# EAGLE schematic 436-300-001 Main Power Enclosure (EAGLE 6.5.0)

## Sheet 1 of 2
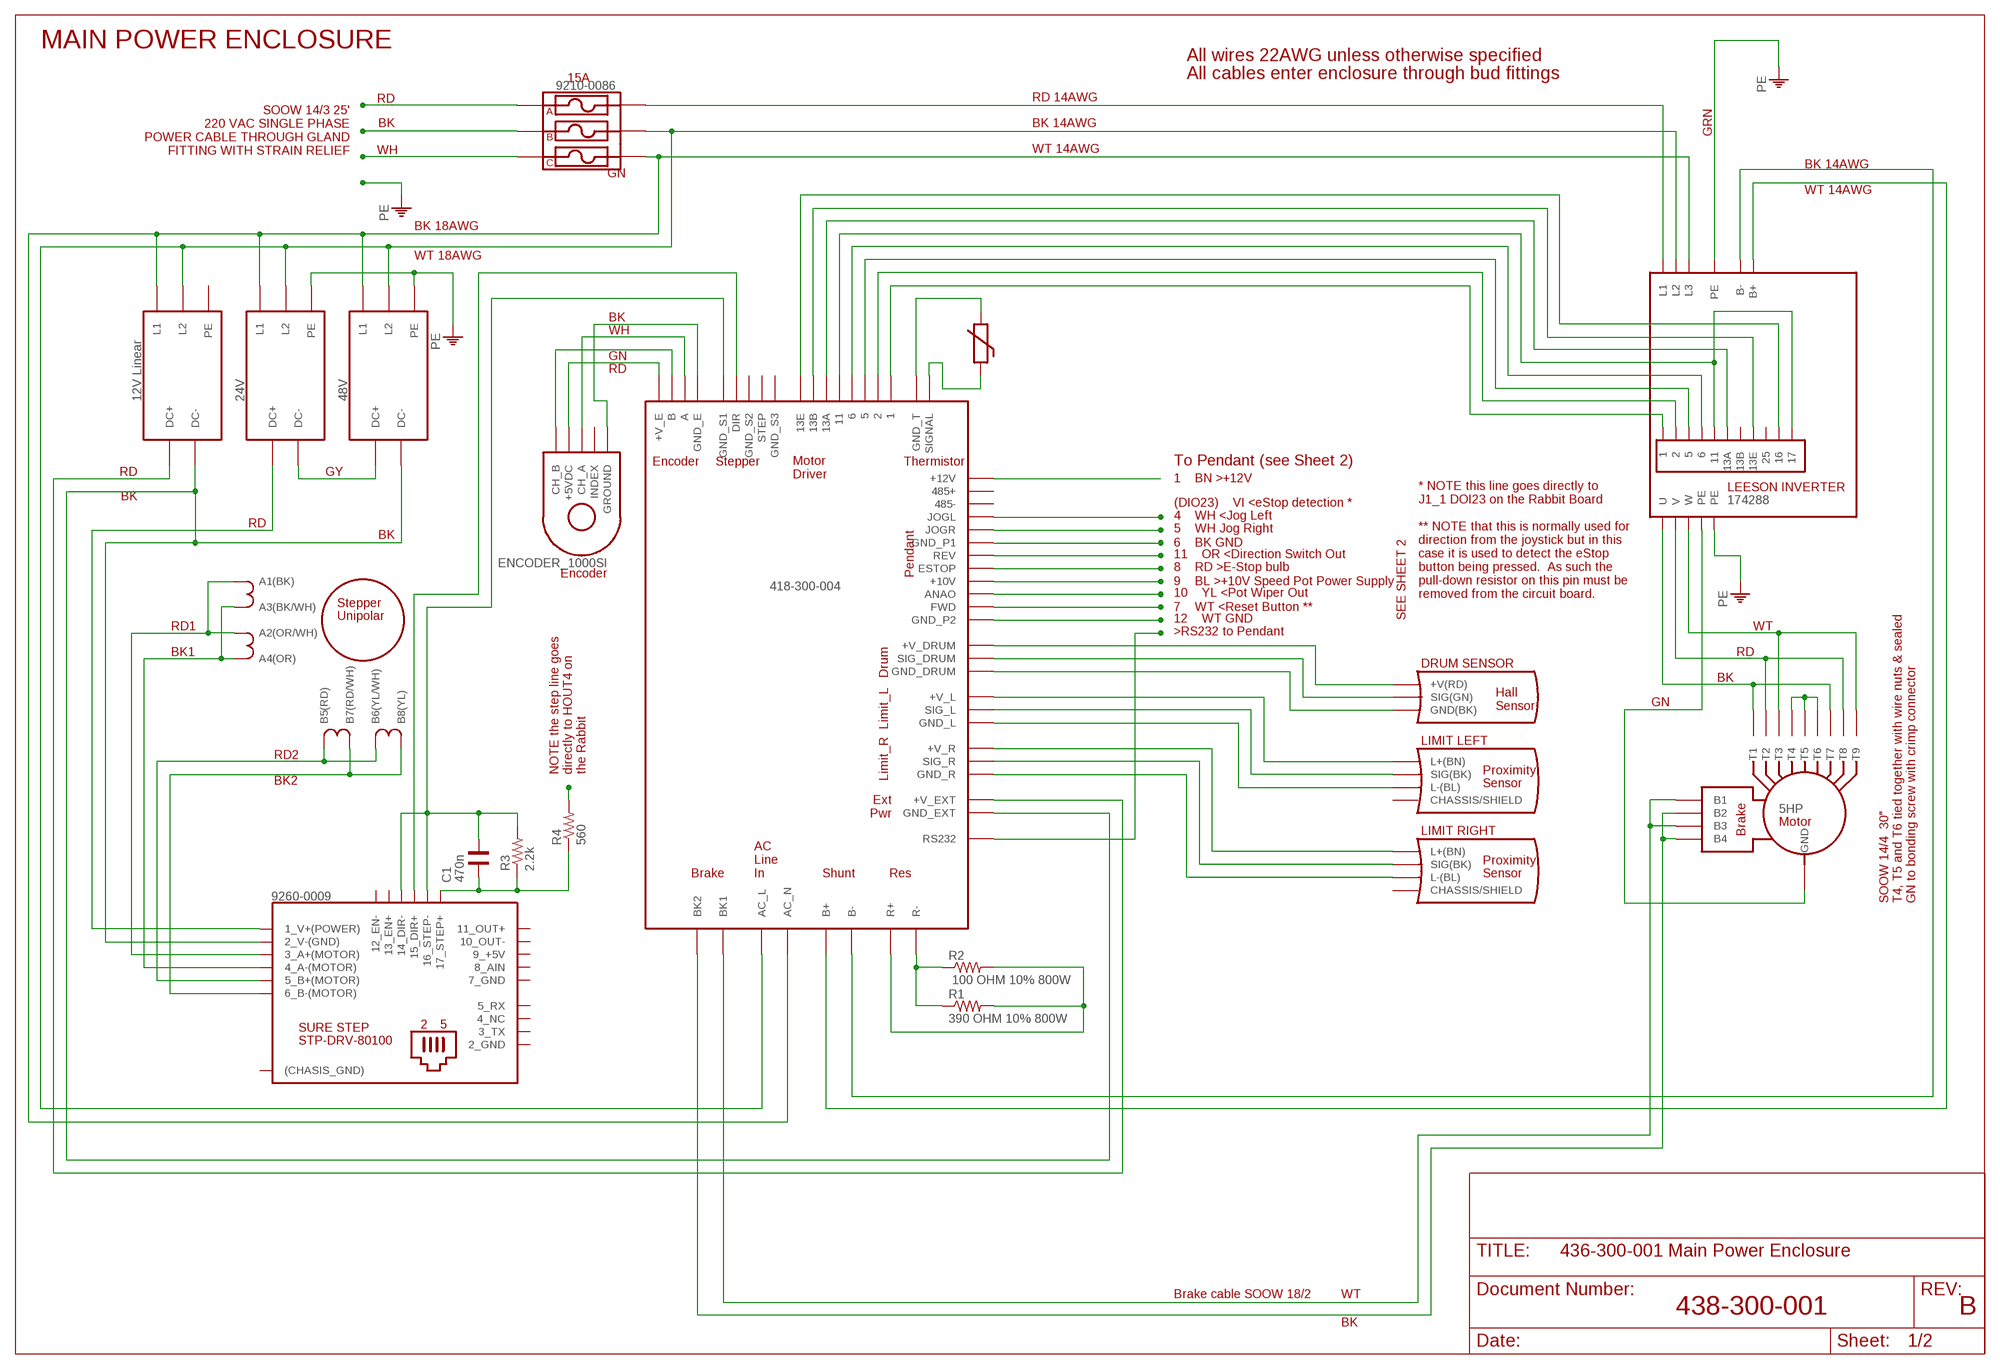
[diagram p0: schematic, sheet 1]

### Parts
C1  470n  C0805  [C0805]
R1  390 OHM 10% 800W  RESISTORKIT  [AXIAL-0.3-KIT]
R2  100 OHM 10% 800W  RESISTORKIT  [AXIAL-0.3-KIT]
R3  2.2k  RESISTOR0805-RES  [0805]
R4  560  RESISTOR0805-RES  [0805]
U$1  CONTROLLER_ECO_0.2  [BOGUS@2]
U$2  THERMISTOR  [BOGUS]
U$3  SENSOR_HALL  [BOGUS@1]
U$4  ENCODER_1000SI  [BOGUS]
U$6  SENSOR_PROXIMITY  [BOGUS]
U$7  5HP  MOTOR_3PH  [BOGUS]
U$8  174288  INVERTER_LEESON_3-PHASE  [BOGUS@2]
U$9  SENSOR_PROXIMITY  [BOGUS]
U$10  24V  POWER_SUPPLY  [BOGUS]
U$11  FUSE_HOLDER_3-POLE  [BOGUS]
U$12  48V  POWER_SUPPLY  [BOGUS]
U$13  MOTOR_STEPPER_UNIPOLAR  [BOGUS]
U$14  SURE_STEP_STP-DRV-80100  [BOGUS]
U$18  12V Linear  POWER_SUPPLY  [BOGUS]

### Nets
N$1: U$8.P$14(L1) U$11.P$3
N$2: U$1.P$36(GND_R) U$9.P$3(L-(BL))
N$3: U$11.P$2
N$4: U$11.P$1
N$5: U$7.P$8(T4) U$7.P$9(T5) U$7.P$10(T6)
N$6: U$1.P$50(SIG_R) U$9.P$4(SIG(BK))
N$7: U$1.P$7(+V_R) U$9.P$2(L+(BN))
N$8: U$7.P$6(T2) U$7.P$12(T8) U$8.P$21(V)
N$9: U$7.P$5(T1) U$7.P$11(T7) U$8.P$20(U)
N$10: U$7.P$14(GND) U$8.P$18(PE)
N$11: U$7.P$7(T3) U$7.P$13(T9) U$8.P$22(W)
N$12: U$1.P$6(+V_L) U$6.P$2(L+(BN))
N$13: U$1.P$49(SIG_L) U$6.P$4(SIG(BK))
N$14: U$1.P$33(GND_L) U$6.P$3(L-(BL))
N$15: U$1.P$26(BK2) U$7.P$2(B2) U$7.P$4(B4)
N$16: U$1.P$19(AC_L) U$8.P$15(L2) U$10.P$4(L2) U$11.P$4 U$12.P$4(L2) U$18.P$4(L2)
N$17: U$1.P$40(GND_T) U$2.P$1
N$18: U$1.P$47(SIGNAL) U$2.P$2
N$19: U$1.P$8 U$8.P$1
N$20: U$1.P$46(RS232)
N$21: U$1.P$9 U$8.P$2
N$22: U$1.P$25(BK1) U$7.P$1(B1) U$7.P$3(B3)
N$23: U$1.P$15(13E) U$8.P$9
N$24: U$1.P$20(AC_N) U$8.P$16(L3) U$10.P$3(L1) U$11.P$6 U$12.P$3(L1) U$18.P$3(L1)
N$25: U$1.P$10 U$8.P$3
N$26: U$1.P$11 U$8.P$4
N$27: U$1.P$12 U$8.P$5 U$8.P$10
N$32: U$1.P$13(13A) U$8.P$6(13A)
N$34: U$1.P$3(+V_DRUM) U$3.P$1(+V(RD))
N$35: U$1.P$48(SIG_DRUM) U$3.P$3(SIG(GN))
N$36: R1.P$1 R2.P$1 U$1.P$44(R-)
N$37: U$1.P$30(GND_DRUM) U$3.P$2(GND(BK))
N$38: U$1.P$14(13B) U$8.P$8(13E)
N$40: U$1.P$4(+V_E) U$4.P$1(+5VDC)
N$41: U$1.P$22(B) U$4.P$3(CH_B)
N$42: U$1.P$18(A) U$4.P$2(CH_A)
N$43: U$1.P$31(GND_E) U$4.P$4(GROUND)
N$44: U$1.P$2(+12V)
N$45: U$1.P$41(JOGL)
N$46: U$1.P$34(GND_P1)
N$47: U$1.P$42(JOGR)
N$48: U$1.P$45(REV)
N$49: U$1.P$28(ESTOP)
N$50: U$1.P$1(+10V)
N$51: U$1.P$21(ANAO)
N$52: U$1.P$29(FWD)
N$53: U$11.P$5
N$54: U$1.P$5(+V_EXT) U$18.P$1(DC+)
N$55: U$1.P$32(GND_EXT) U$12.P$2(DC-) U$14.P$3(2_V-(GND)) U$18.P$2(DC-)
N$56: U$1.P$24(B-) U$8.P$13(B-)
N$57: U$1.P$23(B+) U$8.P$12(B+)
N$59: C1.2 R3.2 U$1.P$37(GND_S1) U$14.P$15(14_DIR-) U$14.P$17(16_STEP-)
N$60: C1.1 R3.1 R4.1 U$14.P$18(17_STEP+)
N$61: U$1.P$27(DIR) U$14.P$16(15_DIR+)
N$62: U$1.P$35(GND_P2)
N$64: U$13.P$3(A3(BK/WH)) U$13.P$4(A4(OR)) U$14.P$5(4_A-(MOTOR))
N$65: U$13.P$1(A1(BK)) U$13.P$2(A2(OR/WH)) U$14.P$4(3_A+(MOTOR))
N$66: U$10.P$1(DC+) U$14.P$2(1_V+(POWER))
N$67: R1.P$2 R2.P$2 U$1.P$43(R+)
N$68: U$10.P$2(DC-) U$12.P$1(DC+)
N$69: U$13.P$5(B5(RD)) U$13.P$6(B6(YL/WH)) U$14.P$6(5_B+(MOTOR))
N$70: U$13.P$7(B7(RD/WH)) U$13.P$8(B8(YL)) U$14.P$7(6_B-(MOTOR))
N$76: R4.2
PE: U$8.P$17(PE) U$8.P$19(PE) U$10.P$5(PE) U$12.P$5(PE)
Unconnected: U$1.P$16(485+) U$1.P$17(485-) U$1.P$38(GND_S2) U$1.P$39(GND_S3) U$1.P$51(STEP) U$4.P$5(INDEX) U$6.P$1(CHASSIS/SHIELD) U$8.P$7(13B) U$8.P$11 U$9.P$1(CHASSIS/SHIELD) U$18.P$5(PE)

### Notes on the sheet
- MAIN POWER ENCLOSURE
- All wires 22AWG unless otherwise specified
- 15A | All cables enter enclosure through bud fittings
- RD | RD 14AWG
- SOOW 14/3 25'
  220 VAC SINGLE PHASE
  POWER CABLE THROUGH GLAND
  FITTING WITH STRAIN RELIEF
- BK | BK 14AWG
- GRN
- WH | WT 14AWG
- BK 14AWG
- GN
- WT 14AWG
- BK 18AWG
- WT 18AWG
- BK
- WH
- GN
- RD
- To Pendant (see Sheet 2)
- RD | GY
- 1    BN >+12V
- BK
- (DIO23)    VI <eStop detection *
- 4    WH <Jog Left
- RD
- 5    WH Jog Right
- BK
- 6    BK GND
- 11    OR <Direction Switch Out
- 8    RD >E-Stop bulb
- 9    BL >+10V Speed Pot Power Supply
- 10    YL <Pot Wiper Out
- * NOTE this line goes directly to
  J1_1 DOI23 on the Rabbit Board
  
  ** NOTE that this is normally used for
  direction from the joystick but in this 
  case it is used to detect the eStop 
  button being pressed.  As such the 
  pull-down resistor on this pin must be 
  removed from the circuit board.
- 7    WT <Reset Button **
- 12    WT GND | SEE SHEET 2
- RD1 | WT
- >RS232 to Pendant
- BK1 | RD
- DRUM SENSOR
- BK
- GN
- LIMIT LEFT
- RD2
- NOTE the step line goes 
  directly to HOUT4 on
  the Rabbit
- BK2
- LIMIT RIGHT
- SOOW 14/4  30"
  T4, T5 and T6 tied together with wire nuts & sealed
  GN to bonding screw with crimp connector
- Brake cable SOOW 18/2 | WT
- 438-300-001 | B
- BK

## Sheet 2 of 2
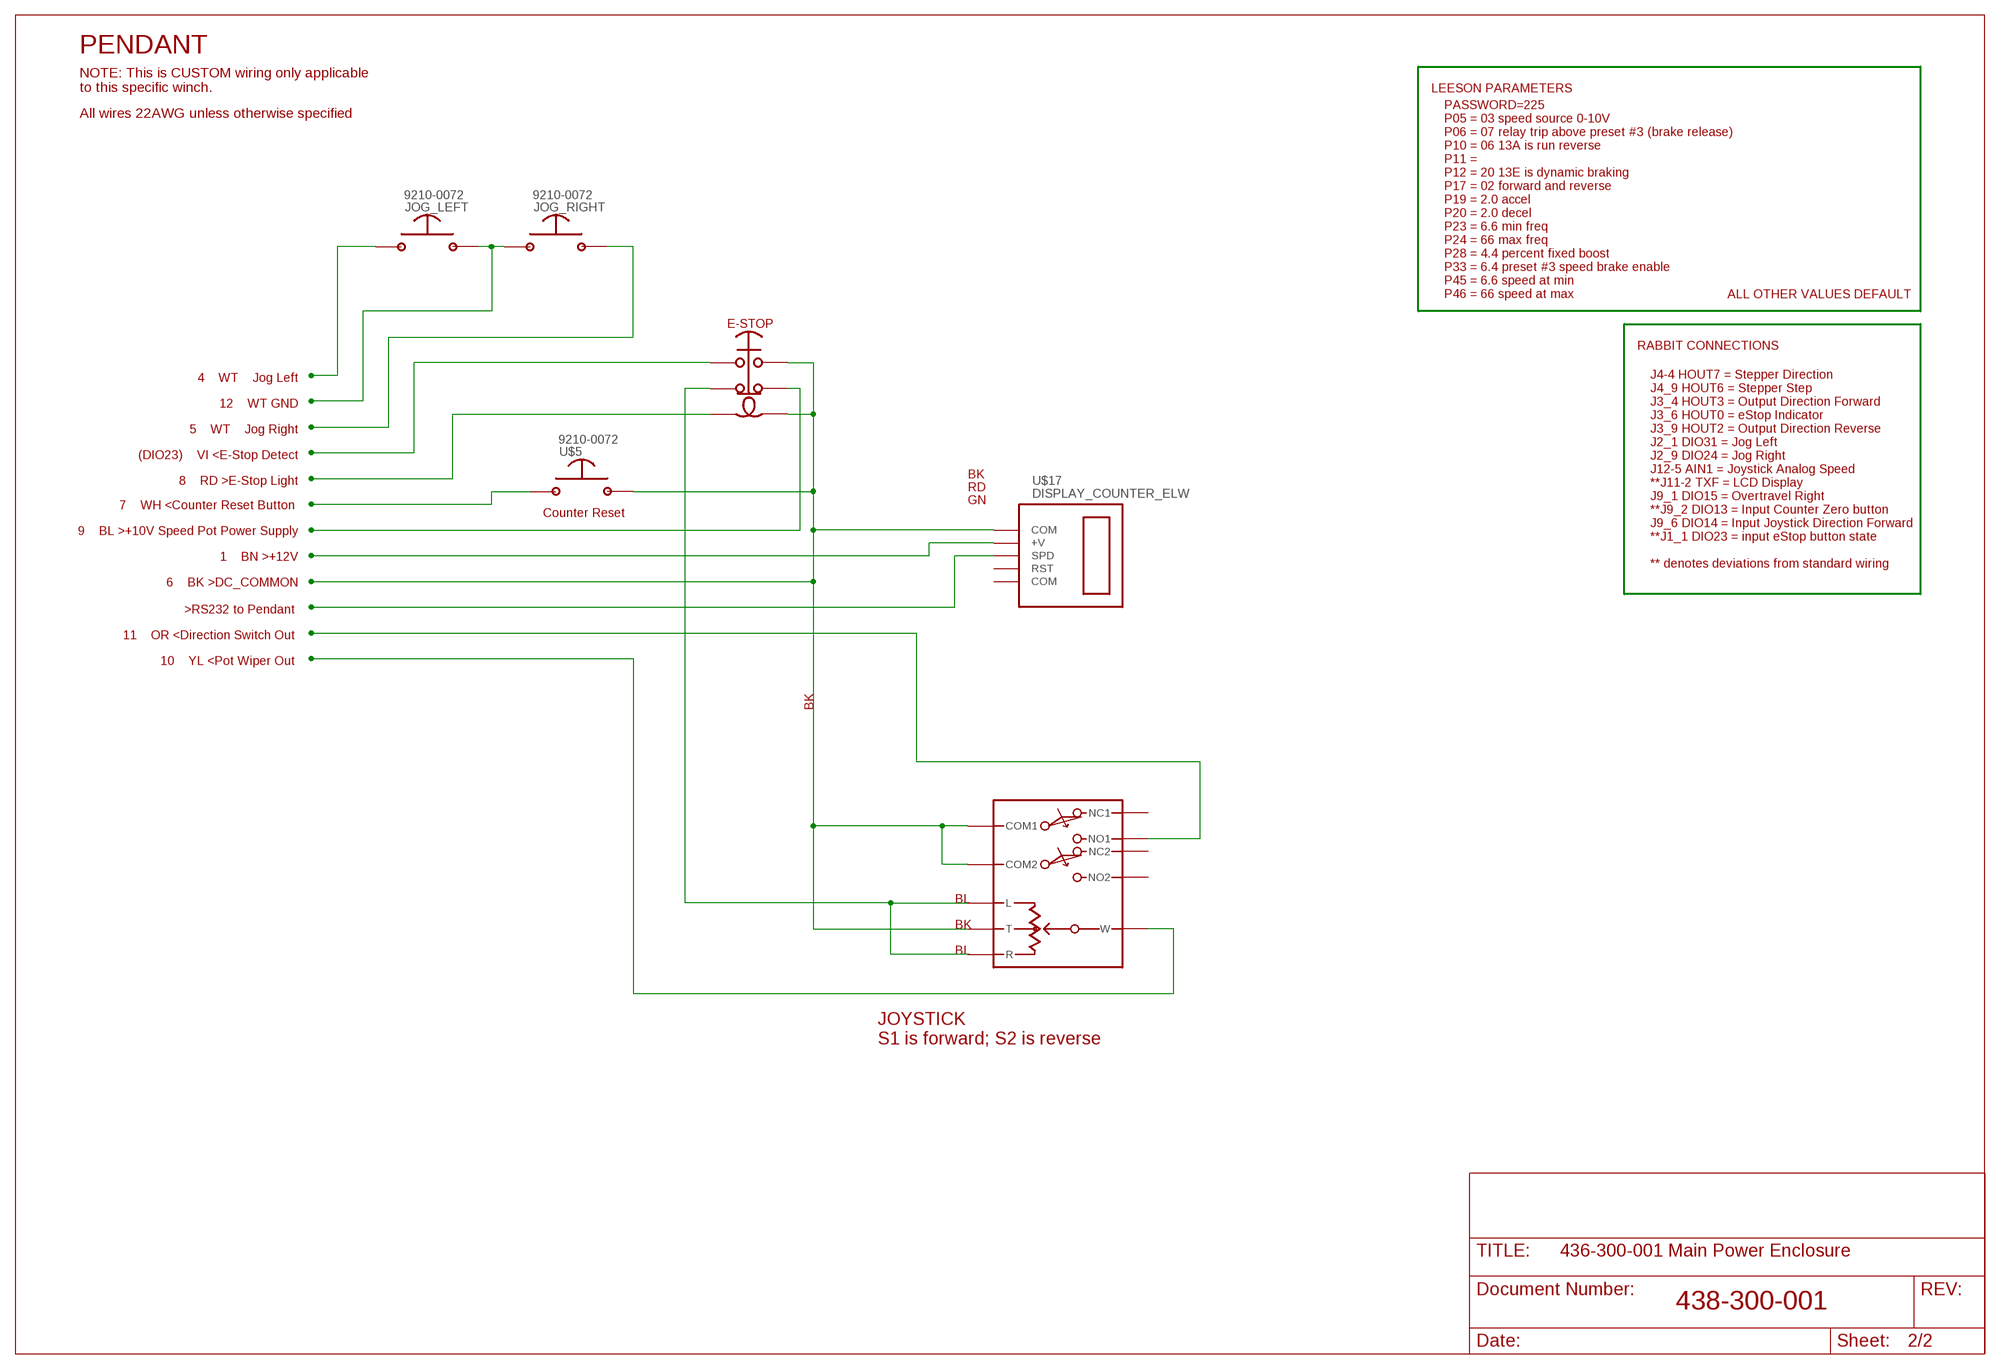
[diagram p1: schematic, sheet 2]

### Parts
JOG_LEFT  Counter Reset  SWITCH_MOM_NO  [BOGUS]
JOG_RIGHT  Counter Reset  SWITCH_MOM_NO  [BOGUS]
U$5  Counter Reset  SWITCH_MOM_NO  [BOGUS]
U$15  SWITCH_ESTOP_LIGHTED  [BOGUS]
U$16  JOYSTICK_PRO-5  [BOGUS]
U$17  DISPLAY_COUNTER_ELW  [BOGUS]

### Nets
N$28: U$17.P$5(SPD)
N$29: U$5.P$1
N$30: U$15.P$1
N$31: U$15.P$2 U$16.P$3(L) U$16.P$8(R)
N$33: U$5.P$2 U$15.P$3 U$15.P$6 U$16.P$1(COM1) U$16.P$2(COM2) U$16.P$9(T) U$17.P$2(COM)
N$58: JOG_RIGHT.P$2
N$63: U$15.P$5
N$71: JOG_LEFT.P$2 JOG_RIGHT.P$1
N$72: U$16.P$6(NO1)
N$73: U$16.P$10(W)
N$74: U$15.P$4
N$75: U$17.P$1(+V)
N$77: JOG_LEFT.P$1
Unconnected: U$16.P$4(NC1) U$16.P$5(NC2) U$16.P$7(NO2) U$17.P$3(COM) U$17.P$4(RST)

### Notes on the sheet
- PENDANT
- NOTE: This is CUSTOM wiring only applicable 
  to this specific winch.
- LEESON PARAMETERS
- All wires 22AWG unless otherwise specified
- PASSWORD=225
  P05 = 03 speed source 0-10V
  P06 = 07 relay trip above preset #3 (brake release)
  P10 = 06 13A is run reverse
  P11 =
  P12 = 20 13E is dynamic braking
  P17 = 02 forward and reverse
  P19 = 2.0 accel
  P20 = 2.0 decel
  P23 = 6.6 min freq
  P24 = 66 max freq
  P28 = 4.4 percent fixed boost
  P33 = 6.4 preset #3 speed brake enable
  P45 = 6.6 speed at min
  P46 = 66 speed at max
- ALL OTHER VALUES DEFAULT
- RABBIT CONNECTIONS
- 4    WT    Jog Left
- 12    WT GND
- 5    WT    Jog Right
- (DIO23)    VI <E-Stop Detect
- 8    RD >E-Stop Light | BK
- RD
- 7    WH <Counter Reset Button
- GN
- Counter Reset
- 9    BL >+10V Speed Pot Power Supply
- 1    BN >+12V
- 6    BK >DC_COMMON
- J4-4 HOUT7 = Stepper Direction
  J4_9 HOUT6 = Stepper Step
  J3_4 HOUT3 = Output Direction Forward
  J3_6 HOUT0 = eStop Indicator
  J3_9 HOUT2 = Output Direction Reverse
  J2_1 DIO31 = Jog Left
  J2_9 DIO24 = Jog Right
  J12-5 AIN1 = Joystick Analog Speed
  **J11-2 TXF = LCD Display
  J9_1 DIO15 = Overtravel Right
  **J9_2 DIO13 = Input Counter Zero button
  J9_6 DIO14 = Input Joystick Direction Forward
  **J1_1 DIO23 = input eStop button state
  
  ** denotes deviations from standard wiring
- >RS232 to Pendant
- 11    OR <Direction Switch Out
- 10    YL <Pot Wiper Out
- BK
- BL
- BK
- BL
- JOYSTICK
  S1 is forward; S2 is reverse
- 438-300-001

## Power pins joined to a net without a drawn wire
2_GND: U$14.P$19(2_GND)
3_TX: U$14.P$20(3_TX)
4_NC: U$14.P$21(4_NC)
5_RX: U$14.P$22(5_RX)
7_GND: U$14.P$8(7_GND)
8_AIN: U$14.P$9(8_AIN)
9_+5V: U$14.P$10(9_+5V)
10_OUT-: U$14.P$11(10_OUT-)
11_OUT+: U$14.P$12(11_OUT+)
12_EN-: U$14.P$13(12_EN-)
13_EN+: U$14.P$14(13_EN+)
(CHASIS_GND): U$14.P$1((CHASIS_GND))

## Library data of the parts
C1 = DougM-SOSI-ResCap:C0805: chicklet part - capacitor 0805
JOG_LEFT JOG_RIGHT U$5 = DougM-SOSI-Wiring-Diagram:SWITCH_MOM_NO: 9210-0072 Mouser Part #: 850-59-313 Manufacturer Part #: 59-313
R1-R4 = DougM-SOSI-ResCap:RESISTOR: Resistor Basic schematic elements and footprints for 0603, 1206, and PTH resistors.
U$1 = DougM-SOSI-Wiring-Diagram.rpt:CONTROLLER_ECO_0.2: 418-300-004 ECO Controller 0.2 SOSI
U$2 = DougM-SOSI-Wiring-Diagram.rpt:THERMISTOR: (no PN available) (no description available) Soundnine Inc. (no vendor PN available)
U$3 = DougM-SOSI-Wiring-Diagram.rpt:SENSOR_HALL
U$4 = DougM-SOSI-Wiring-Diagram.rpt:ENCODER_1000SI: (no PN) 1000SI Single-Ended Encoder with Index Channel (comes as part of Stepper Motor assembly 9500-0016) Anaheim Automation
U$6 U$9 = DougM-SOSI-Wiring-Diagram.rpt:SENSOR_PROXIMITY: 9210-0023 Proximity Sensor, Inductive, 5mm Dia., 10-30 VDC, 3-wire, NPN, Shielded, 1.5mm nominal sensing distance, N.O., 2-meter cable 9210-0088 Proximity Sensor, Inductive, 12mm Dia., 10-30 VDC, 3-wire, unshielded, 8mm nominal sensing distance, N.O., 2-meter cable 9210-0191 Proximity Sensor, Inductive, 8mm Dia., extended range, 10-30 VDC, 3-wire, NPN, N.O., 4mm nominal sensing distance, unshielded 2-meter cable 9210-0284 Sensor, Proximity, Inductive, 18mm Dia., Extended Range, 10-30 VDC, 3 Wire, NPN, shielded, 2-Meter Cable Manufacturer Automation Direct
U$7 = DougM-SOSI-Wiring-Diagram:MOTOR_3PH: 9500-0000 113020 Electric motor, washdown, 1HP, 208-230/460VAC, 3 phase, 1725 RPM, 56C mounting 9500-0005 G120762 Electric Motor, Washdown, 2HP, 208-230/460V, 60Hz, Cont., 1800 RPM, TEFC, 145TC 9500-0007 CEWDBM3611T BrakeMotor, Electric, Washdown, 3HP, 208-230/460V, 1760RPM, 3 Ph., 60Hz, 182TC, TEFC 9500-0009 G140467.00 Electric Motor, Washdown, 7.5HP, 220 VAC, 50-60 Hz, 3 Phase, 213TC Frame, No Base Leeson Kaman Industrial Technologies McGuire Bearing
U$8 = DougM-SOSI-Wiring-Diagram.rpt:INVERTER_LEESON_3-PHASE: 9260-0001 174265 Motor control, adjustable speed, 1HP, 110VAC single phase input, 220VAC 3 phase output 9260-0002 174270 Motor control, adjustable speed, 1HP, 220VAC single phase input, 220VAC 3 phase output 9260-0006 174278 Inverter, SM Series, 2HP, 208/240 VAC, 3-Phase 9260-0007 174279 Inverter, SM Series, 3HP, 208/240 VAC, 3-Phase 9260-0008 174280 Inverter, SM Series, 7.5HP, 208/240 VAC, 3-Phase 9260-0016 174432 Inverter, SM Series, 20HP, 400-480V, 3-Phase 9260-0017 174282 Inverter, SM Series, 1HP, 400-480V, 3-Phase 9260-0021 174273 Inverter, SM Series, 3HP, 208/240 VAC, 1 phase 9260-0022 174272 Inverter, SM Series, 2HP, 208/240 VAC, 1 phase Leeson Allied Electronics McGuire Bearing
U$10 U$12 U$18 = DougM-SOSI-Wiring-Diagram.rpt:POWER_SUPPLY: 9210-0283 VGD-60-D524 Power Supply, VGD Series, AC/DC Convert Dual, 5/24V 60W, ENC 9260-0010 HRPG-200-48 Power Supply, 48VDC, 200W Single Output w/ PFC Function 9260-0011 USP-500-48 48VDC 500 Watt Power Supply 9260-0019 HC24-2.4-AG Linear Power Supply, 24V, 2.4A Output 9260-0020 HRPG-200-24 Power Supply, Linear & Switching, 24VDC, 201.6W, 8.4A, w/ PFC 9350-0002 UTC-3124 Signal Conditioner and Power Supply
U$11 = DougM-SOSI-Wiring-Diagram.rpt:FUSE_HOLDER_3-POLE: 9210-0086 BC6033PQ Fuseholder, Class CC & Class G, 3 pole, 600V, 30A, for 13/32x1 1/2 fuses Cooper/Bussman North Coast Electric
U$13 = DougM-SOSI-Wiring-Diagram.rpt:MOTOR_STEPPER_UNIPOLAR: 9500-0016 34Y214D-LW8-1000SI Stepper Motor with 1000 line encoder Anaheim Automation Kaman Industrial Technologies
U$14 = DougM-SOSI-Wiring-Diagram.rpt:SURE_STEP_STP-DRV-80100: 9260-0009 STP-DRV-80100 Step Motor Driver, 80 V 10A Sure Step Automation Direct
U$15 = DougM-SOSI-Wiring-Diagram:SWITCH_ESTOP_LIGHTED: 9210-0045 Switch, Emergency Stop, w/ #800T-XA4 contact block (old #800H-FRXTQH10RA4) Allen Bradley 800H-FRXTQH2RA4
U$16 = DougM-SOSI-Wiring-Diagram:JOYSTICK_PRO-5: 9280-0000 PRO5-202.1085 (w/20k center tap potentiometer) Joystick (Master Switch), w/20k center tap potentiometer J. R. Merritt Controls
U$17 = DougM-SOSI-Wiring-Diagram:DISPLAY_COUNTER_ELW: 9215-0003 12062A-1 Display Board Assy., ECO-ELW line speed/counter Soundnine Inc.